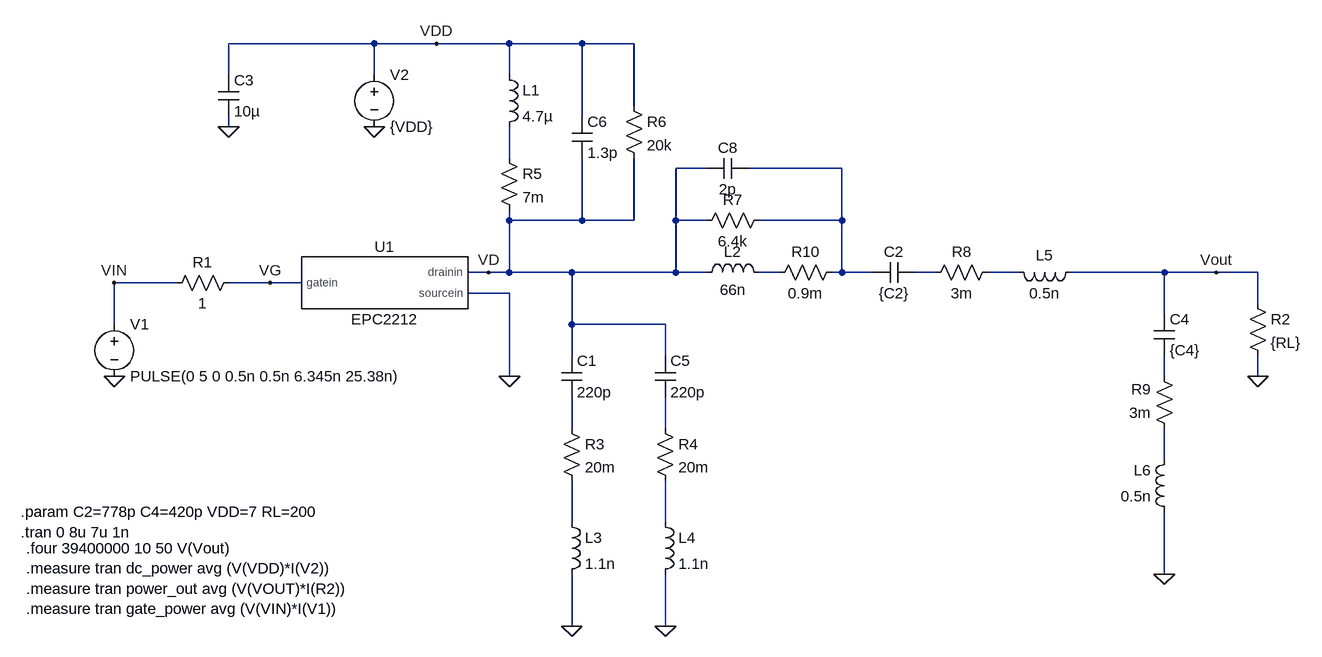
[diagram p0: schematic GaN_Class_E.asc]
GaN_Class_E.asc, the LTspice schematic file:
Version 4
SHEET 1 2352 684
WIRE 464 -272 240 -272
WIRE 560 -272 464 -272
WIRE 672 -272 560 -272
WIRE 784 -272 672 -272
WIRE 864 -272 784 -272
WIRE 240 -224 240 -272
WIRE 464 -224 464 -272
WIRE 672 -224 672 -272
WIRE 864 -176 864 -272
WIRE 784 -160 784 -272
WIRE 240 -144 240 -160
WIRE 672 -96 672 -144
WIRE 976 -80 928 -80
WIRE 1184 -80 1040 -80
WIRE 672 0 672 -16
WIRE 784 0 784 -96
WIRE 784 0 672 0
WIRE 864 0 864 -96
WIRE 864 0 784 0
WIRE 928 0 928 -80
WIRE 976 0 928 0
WIRE 1184 0 1184 -80
WIRE 1184 0 1056 0
WIRE 640 80 608 80
WIRE 672 80 672 0
WIRE 672 80 640 80
WIRE 768 80 672 80
WIRE 928 80 928 0
WIRE 928 80 768 80
WIRE 976 80 928 80
WIRE 1088 80 1056 80
WIRE 1184 80 1184 0
WIRE 1184 80 1168 80
WIRE 1232 80 1184 80
WIRE 1328 80 1296 80
WIRE 1456 80 1408 80
WIRE 1680 80 1536 80
WIRE 1760 80 1680 80
WIRE 1824 80 1760 80
WIRE 160 96 64 96
WIRE 304 96 240 96
WIRE 352 96 304 96
WIRE 672 112 608 112
WIRE 1824 128 1824 80
WIRE 1680 144 1680 80
WIRE 64 160 64 96
WIRE 768 160 768 80
WIRE 912 160 768 160
WIRE 768 208 768 160
WIRE 912 208 912 160
WIRE 672 240 672 112
WIRE 1680 240 1680 208
WIRE 1824 240 1824 208
WIRE 768 320 768 272
WIRE 912 320 912 272
WIRE 1680 368 1680 320
WIRE 768 464 768 400
WIRE 912 464 912 400
WIRE 1680 544 1680 448
WIRE 768 624 768 544
WIRE 912 624 912 544
FLAG 64 240 0
FLAG 464 -144 0
FLAG 672 240 0
FLAG 1824 240 0
FLAG 304 96 VG
FLAG 640 80 VD
FLAG 1760 80 Vout
FLAG 64 96 VIN
FLAG 560 -272 VDD
FLAG 240 -144 0
FLAG 768 624 0
FLAG 1680 544 0
FLAG 912 624 0
SYMBOL voltage 64 144 R0
WINDOW 123 0 0 Left 0
WINDOW 39 0 0 Left 0
SYMATTR InstName V1
SYMATTR Value PULSE(0 5 0 0.5n 0.5n 6.345n 25.38n)
SYMBOL res 256 80 R90
WINDOW 0 0 56 VBottom 2
WINDOW 3 32 56 VTop 2
SYMATTR InstName R1
SYMATTR Value 1
SYMBOL voltage 464 -240 R0
WINDOW 123 0 0 Left 0
WINDOW 39 0 0 Left 0
SYMATTR InstName V2
SYMATTR Value {VDD}
SYMBOL ind 656 -240 R0
SYMATTR InstName L1
SYMATTR Value 4.7µ
SYMBOL ind 960 96 R270
WINDOW 0 32 56 VTop 2
WINDOW 3 5 56 VBottom 2
SYMATTR InstName L2
SYMATTR Value 66n
SYMBOL cap 1296 64 R90
WINDOW 0 0 32 VBottom 2
WINDOW 3 32 32 VTop 2
SYMATTR InstName C2
SYMATTR Value {C2}
SYMBOL res 1808 112 R0
SYMATTR InstName R2
SYMATTR Value {RL}
SYMBOL cap 224 -224 R0
SYMATTR InstName C3
SYMATTR Value 10µ
SYMBOL cap 1664 144 R0
SYMATTR InstName C4
SYMATTR Value {C4}
SYMBOL EPC2212 480 96 R0
SYMATTR InstName U1
SYMBOL cap 752 208 R0
SYMATTR InstName C1
SYMATTR Value 220p
SYMBOL res 752 304 R0
SYMATTR InstName R3
SYMATTR Value 20m
SYMBOL ind 752 448 R0
SYMATTR InstName L3
SYMATTR Value 1.1n
SYMBOL res 656 -112 R0
SYMATTR InstName R5
SYMATTR Value 7m
SYMBOL cap 768 -160 R0
SYMATTR InstName C6
SYMATTR Value 1.3p
SYMBOL res 848 -192 R0
SYMATTR InstName R6
SYMATTR Value 20k
SYMBOL res 1072 -16 R90
WINDOW 0 0 56 VBottom 2
WINDOW 3 32 56 VTop 2
SYMATTR InstName R7
SYMATTR Value 6.4k
SYMBOL cap 1040 -96 R90
WINDOW 0 0 32 VBottom 2
WINDOW 3 32 32 VTop 2
SYMATTR InstName C8
SYMATTR Value 2p
SYMBOL res 1184 64 R90
WINDOW 0 0 56 VBottom 2
WINDOW 3 32 56 VTop 2
SYMATTR InstName R10
SYMATTR Value 0.9m
SYMBOL res 1424 64 R90
WINDOW 0 0 56 VBottom 2
WINDOW 3 32 56 VTop 2
SYMATTR InstName R8
SYMATTR Value 3m
SYMBOL ind 1552 64 R90
WINDOW 0 5 56 VBottom 2
WINDOW 3 32 56 VTop 2
SYMATTR InstName L5
SYMATTR Value 0.5n
SYMBOL res 1696 336 R180
WINDOW 0 36 76 Left 2
WINDOW 3 36 40 Left 2
SYMATTR InstName R9
SYMATTR Value 3m
SYMBOL ind 1696 464 R180
WINDOW 0 36 80 Left 2
WINDOW 3 36 40 Left 2
SYMATTR InstName L6
SYMATTR Value 0.5n
SYMBOL cap 896 208 R0
SYMATTR InstName C5
SYMATTR Value 220p
SYMBOL res 896 304 R0
SYMATTR InstName R4
SYMATTR Value 20m
SYMBOL ind 896 448 R0
SYMATTR InstName L4
SYMATTR Value 1.1n
TEXT -80 480 Left 2 !.tran 0 8u 7u 1n
TEXT -80 448 Left 2 !.param C2=778p C4=420p VDD=7 RL=200
TEXT -72 504 Left 2 !.four 39400000 10 50 V(Vout)\n.measure tran dc_power avg (V(VDD)*I(V2))\n.measure tran power_out avg (V(VOUT)*I(R2))\n.measure tran gate_power avg (V(VIN)*I(V1))

The netlist it stands for:
* GaN_Class_E.asc
V1 VIN 0 PULSE(0 5 0 0.5n 0.5n 6.345n 25.38n)
R1 VG VIN 1
V2 VDD 0 {VDD}
L1 VDD N001 4.7µ
L2 VD N003 66n
C2 N004 N002 {C2}
R2 Vout 0 {RL}
C3 VDD 0 10µ
C4 Vout N006 {C4}
XU1 VG VD 0 EPC2212  ; pins gatein drainin sourcein
C1 VD N007 220p
R3 N007 N010 20m
L3 N010 0 1.1n
R5 N001 VD 7m
C6 VDD VD 1.3p
R6 VDD VD 20k
R7 N002 VD 6.4k
C8 N002 VD 2p
R10 N002 N003 0.9m
R8 N005 N004 3m
L5 Vout N005 0.5n
R9 N009 N006 3m
L6 0 N009 0.5n
C5 VD N008 220p
R4 N008 N011 20m
L4 N011 0 1.1n
.tran 0 8u 7u 1n
.param C2=778p C4=420p VDD=7 RL=200
.four 39400000 10 50 V(Vout)
.measure tran dc_power avg (V(VDD)*I(V2))
.measure tran power_out avg (V(VOUT)*I(R2))
.measure tran gate_power avg (V(VIN)*I(V1))
.lib C:\Users\taf27\Desktop\Class-E-Optimization\EPCGaNLibrary\EPCGaNLibrary.lib
.backanno
.end